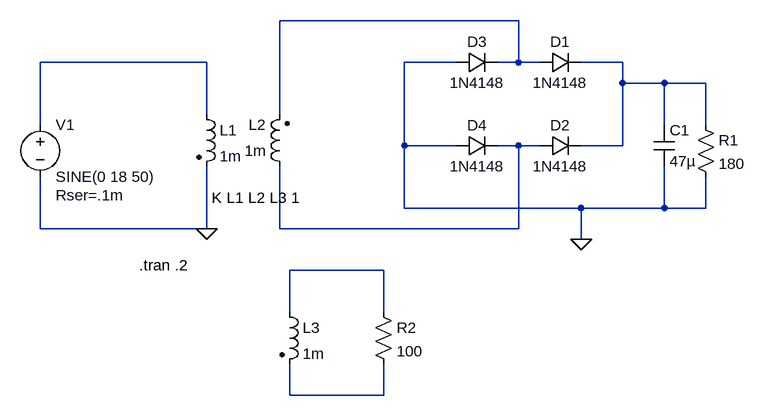
[diagram p0: schematic FullWaveRectifier1.asc]
FullWaveRectifier1.asc, the LTspice schematic file:
Version 4
SHEET 1 880 680
WIRE 272 -48 -96 -48
WIRE -208 16 -464 16
WIRE 176 16 96 16
WIRE 272 16 272 -48
WIRE 272 16 240 16
WIRE 304 16 272 16
WIRE 432 16 368 16
WIRE 432 48 432 16
WIRE 496 48 432 48
WIRE 560 48 496 48
WIRE -208 96 -208 16
WIRE -96 96 -96 -48
WIRE -464 112 -464 16
WIRE 496 112 496 48
WIRE 560 112 560 48
WIRE 96 144 96 16
WIRE 176 144 96 144
WIRE 272 144 240 144
WIRE 304 144 272 144
WIRE 432 144 432 48
WIRE 432 144 368 144
WIRE 96 240 96 144
WIRE 368 240 96 240
WIRE 496 240 496 176
WIRE 496 240 368 240
WIRE 560 240 560 192
WIRE 560 240 496 240
WIRE -464 272 -464 192
WIRE -208 272 -208 176
WIRE -208 272 -464 272
WIRE -96 272 -96 176
WIRE 272 272 272 144
WIRE 272 272 -96 272
WIRE 368 288 368 240
WIRE 64 336 -80 336
WIRE -80 400 -80 336
WIRE 64 400 64 336
WIRE -80 528 -80 480
WIRE 64 528 64 480
WIRE 64 528 -80 528
FLAG 368 288 0
FLAG -208 272 0
SYMBOL voltage -464 96 R0
WINDOW 123 0 0 Left 0
WINDOW 39 24 124 Left 2
SYMATTR InstName V1
SYMATTR Value SINE(0 18 50)
SYMATTR SpiceLine Rser=.1m
SYMBOL diode 304 32 R270
WINDOW 0 32 32 VTop 2
WINDOW 3 0 32 VBottom 2
SYMATTR InstName D1
SYMATTR Value 1N4148
SYMBOL diode 304 160 R270
WINDOW 0 32 32 VTop 2
WINDOW 3 0 32 VBottom 2
SYMATTR InstName D2
SYMATTR Value 1N4148
SYMBOL diode 176 32 R270
WINDOW 0 32 32 VTop 2
WINDOW 3 0 32 VBottom 2
SYMATTR InstName D3
SYMATTR Value 1N4148
SYMBOL diode 176 160 R270
WINDOW 0 32 32 VTop 2
WINDOW 3 0 32 VBottom 2
SYMATTR InstName D4
SYMATTR Value 1N4148
SYMBOL res 544 96 R0
SYMATTR InstName R1
SYMATTR Value 180
SYMBOL ind2 -224 80 R0
SYMATTR InstName L1
SYMATTR Value 1m
SYMATTR Type ind
SYMBOL ind2 -80 192 R180
WINDOW 0 36 80 Left 2
WINDOW 3 36 40 Left 2
SYMATTR InstName L2
SYMATTR Value 1m
SYMATTR Type ind
SYMBOL cap 480 112 R0
SYMATTR InstName C1
SYMATTR Value 47µ
SYMBOL ind2 -96 384 R0
SYMATTR InstName L3
SYMATTR Value 1m
SYMATTR Type ind
SYMBOL res 48 384 R0
SYMATTR InstName R2
SYMATTR Value 100
TEXT -312 328 Left 2 !.tran .2
TEXT -200 224 Left 2 !K L1 L2 L3 1

The netlist it stands for:
* FullWaveRectifier1.asc
V1 N002 0 SINE(0 18 50) Rser=.1m
D1 N001 N003 1N4148
D2 N004 N003 1N4148
D3 0 N001 1N4148
D4 0 N004 1N4148
R1 N003 0 180
L1 N002 0 1m
L2 N004 N001 1m
C1 N003 0 47µ
L3 N005 N006 1m
R2 N005 N006 100
.model D D
.lib standard.dio
.tran .2
K L1 L2 L3 1
.backanno
.end